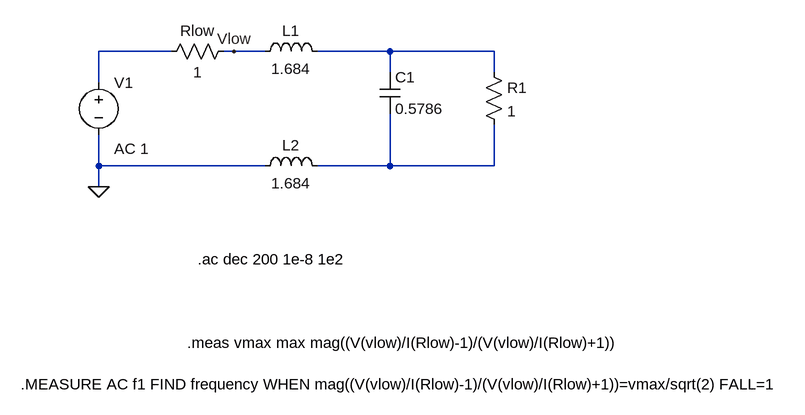
[diagram p0: schematic prototypes2.asc]
prototypes2.asc, the LTspice schematic file:
Version 4
SHEET 1 1144 688
WIRE 192 160 80 160
WIRE 288 160 272 160
WIRE 336 160 288 160
WIRE 528 160 416 160
WIRE 688 160 528 160
WIRE 528 192 528 160
WIRE 688 192 688 160
WIRE 80 208 80 160
WIRE 80 336 80 288
WIRE 336 336 80 336
WIRE 528 336 528 256
WIRE 528 336 416 336
WIRE 688 336 688 272
WIRE 688 336 528 336
WIRE 80 368 80 336
FLAG 288 160 Vlow
FLAG 80 368 0
SYMBOL Res 672 176 R0
SYMATTR InstName R1
SYMATTR Value 1
SYMBOL Res 288 144 R90
WINDOW 0 0 56 VBottom 2
WINDOW 3 32 56 VTop 2
SYMATTR InstName Rlow
SYMATTR Value 1
SYMBOL ind 320 176 R270
WINDOW 0 32 56 VTop 2
WINDOW 3 5 56 VBottom 2
SYMATTR InstName L1
SYMATTR Value 1.684
SYMBOL Voltage 80 192 R0
WINDOW 123 24 118 Left 2
SYMATTR Value2 AC 1
SYMATTR InstName V1
SYMATTR Value ""
SYMBOL cap 512 192 R0
SYMATTR InstName C1
SYMATTR Value 0.5786
SYMBOL ind 320 352 R270
WINDOW 0 32 56 VTop 2
WINDOW 3 5 56 VBottom 2
SYMATTR InstName L2
SYMATTR Value 1.684
TEXT 232 480 Left 2 !.ac dec 200 1e-8 1e2
TEXT -40 672 Left 2 !.MEASURE AC f1 FIND frequency WHEN mag((V(vlow)/I(Rlow)-1)/(V(vlow)/I(Rlow)+1))=vmax/sqrt(2) FALL=1
TEXT 216 608 Left 2 !.meas vmax max mag((V(vlow)/I(Rlow)-1)/(V(vlow)/I(Rlow)+1))

The netlist it stands for:
* prototypes2.asc
R1 N002 N003 1
Rlow Vlow N001 1
L1 Vlow N002 1.684
V1 N001 0 AC 1
C1 N002 N003 0.5786
L2 0 N003 1.684
.ac dec 200 1e-8 1e2
.MEASURE AC f1 FIND frequency WHEN mag((V(vlow)/I(Rlow)-1)/(V(vlow)/I(Rlow)+1))=vmax/sqrt(2) FALL=1
.meas vmax max mag((V(vlow)/I(Rlow)-1)/(V(vlow)/I(Rlow)+1))
.backanno
.end